# EAGLE schematic testmichael (EAGLE 5.91)
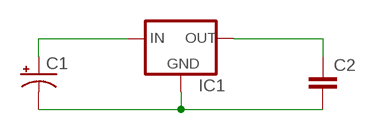
[diagram p0: schematic, sheet 1]

## Parts
C1  CPOL-USE15-5AXIAL  [E15-5]
C2  C-EUC0805  [C0805]
IC1  78XXL  [78XXL]

## Nets
N$1: C1.+ IC1.IN
N$2: C2.1 IC1.OUT
N$3: C1.- C2.2 IC1.GND

## Library data of the parts
C1 = resistor:CPOL-US: POLARIZED CAPACITOR, American symbol
C2 = resistor:C-EU: CAPACITOR, European symbol
IC1 = v-reg:78XXL: VOLTAGE REGULATOR